# EasyEDA Pro project ProPrj_ftdi-jtag-xilinx_2025-01-01.epro, schematic Schematic1

## Sheets
1 FT2232HQ: Board Name: Board1; Create Date: 2024-12-31; Page Name: FT2232HQ; Project Name: ftdi-jtag-xilinx; Schematic Name: Schematic1; Update Date: 2024-12-31; Company: 嘉立创EDA; Page Size: A4; Version: V1.0
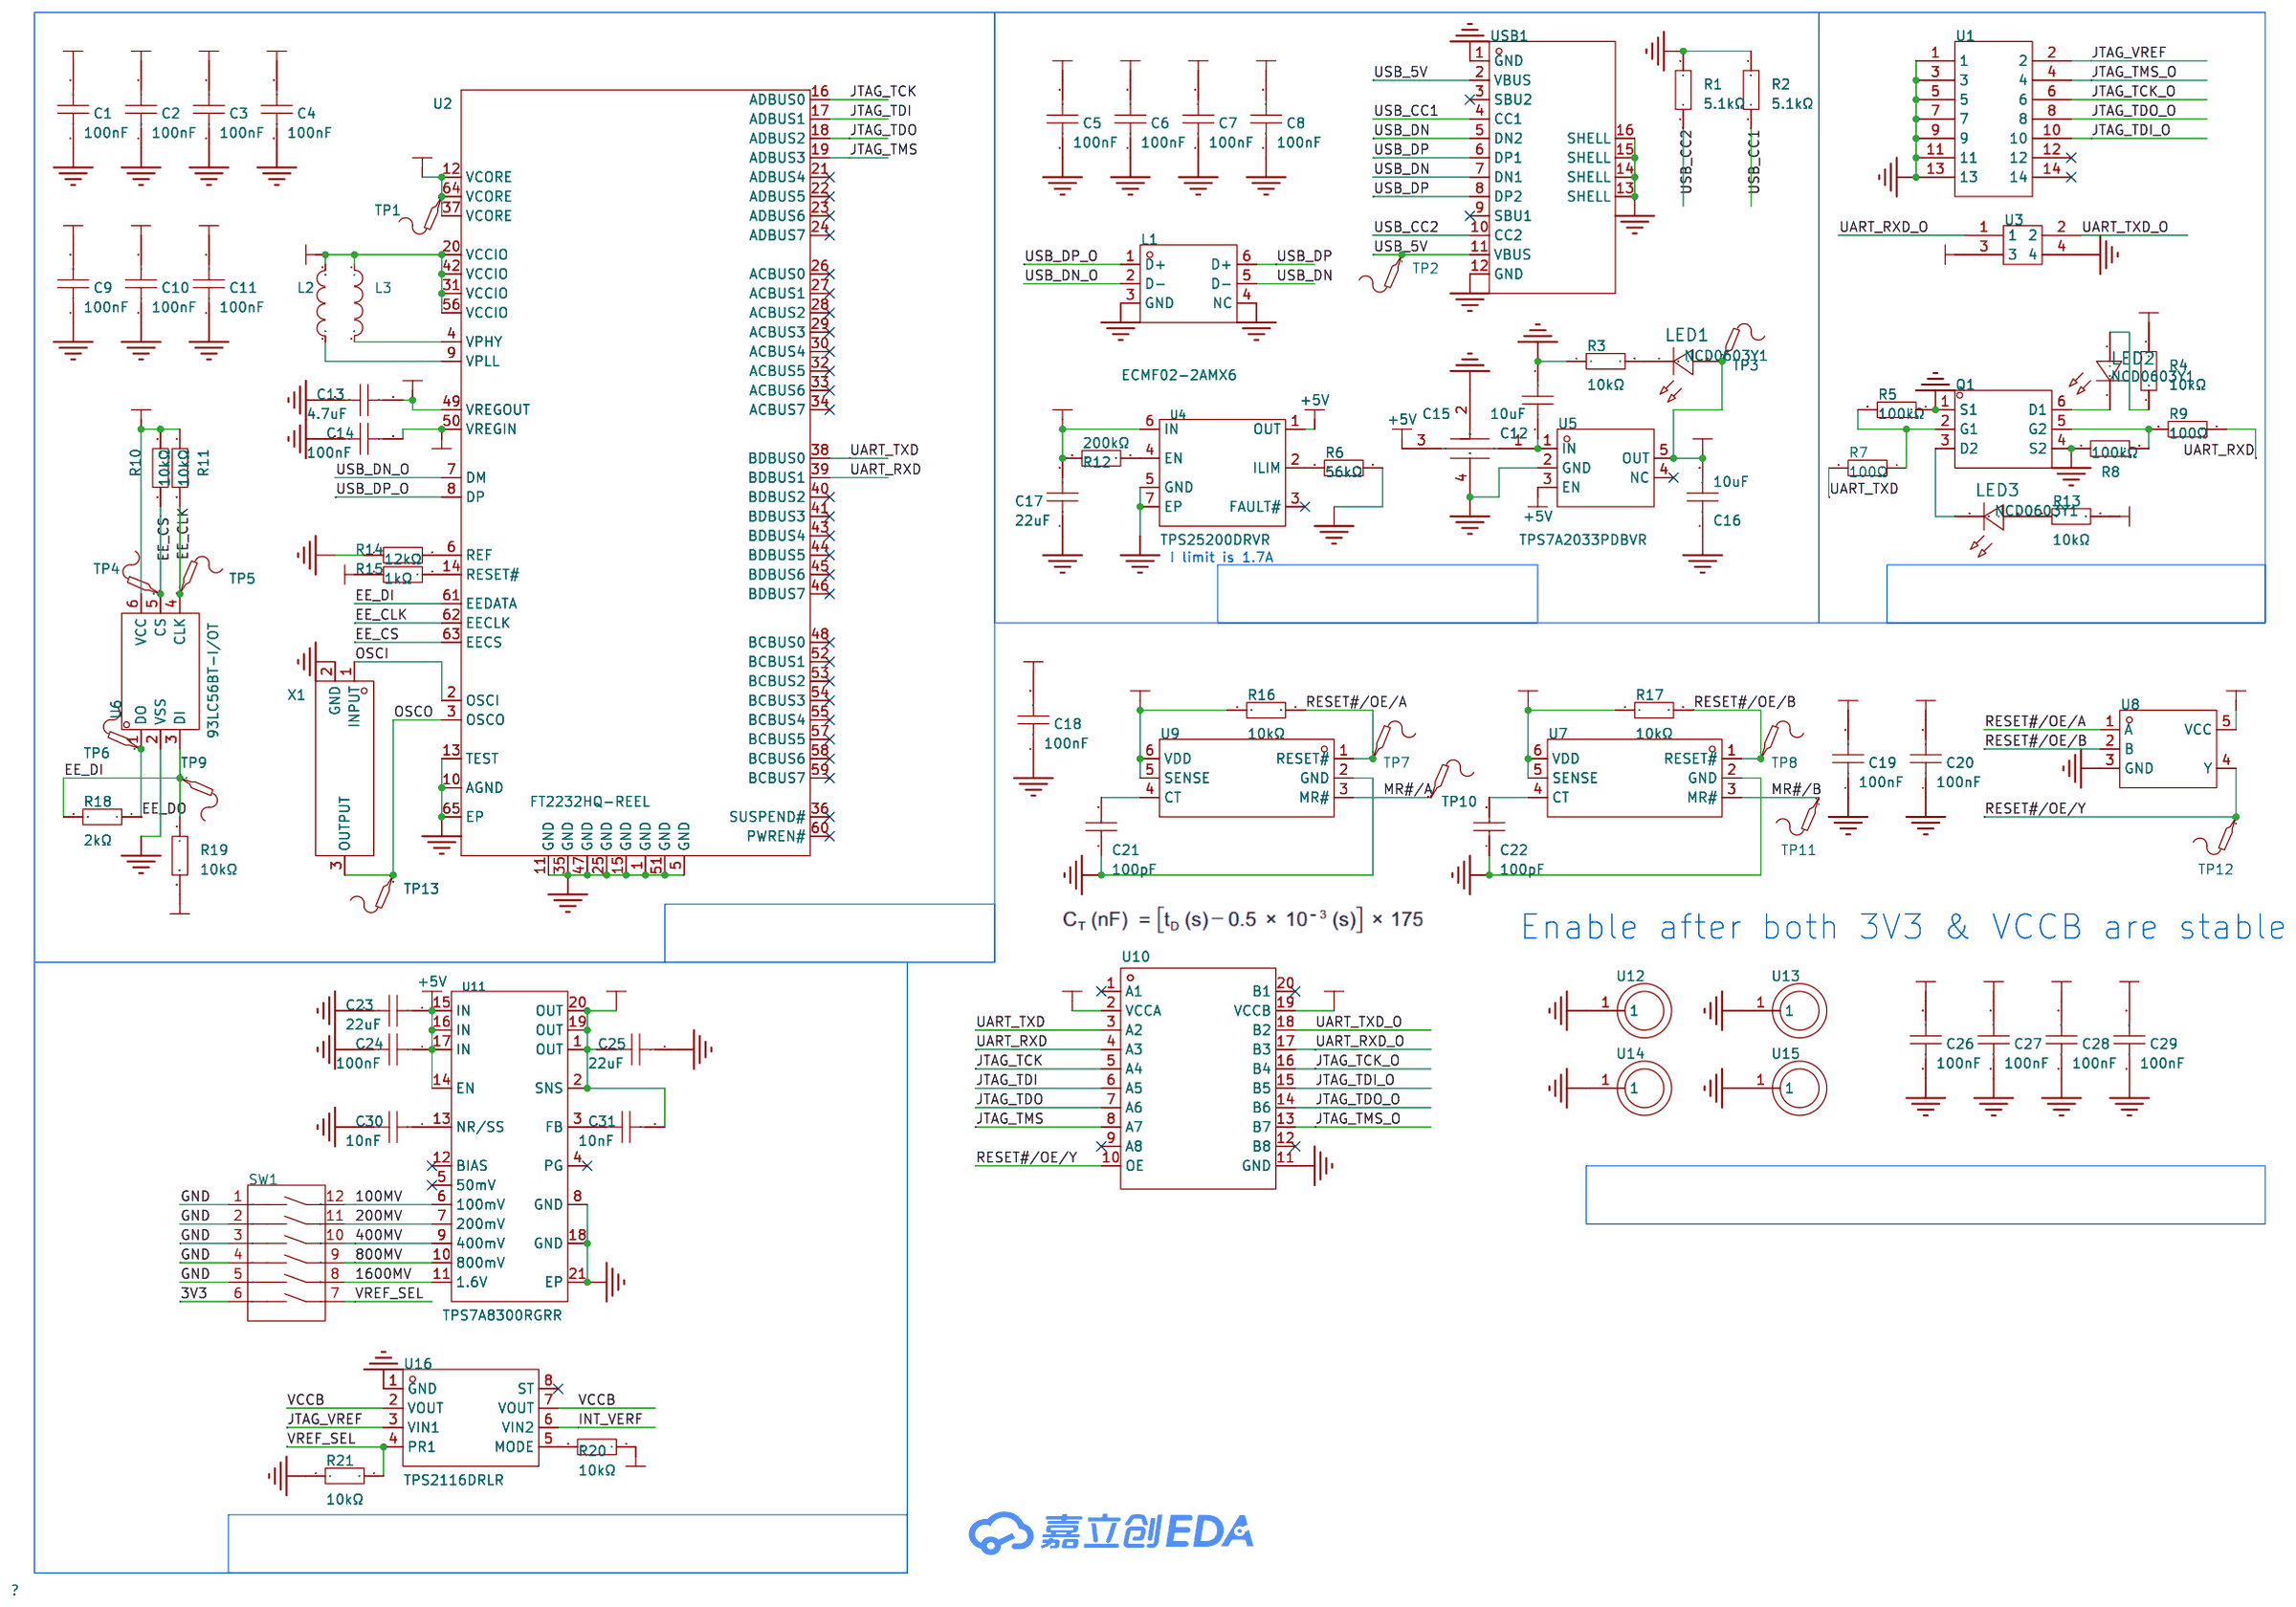
[diagram p0: FT2232HQ]
2 JTAG Adapter: Page Name: JTAG Adapter
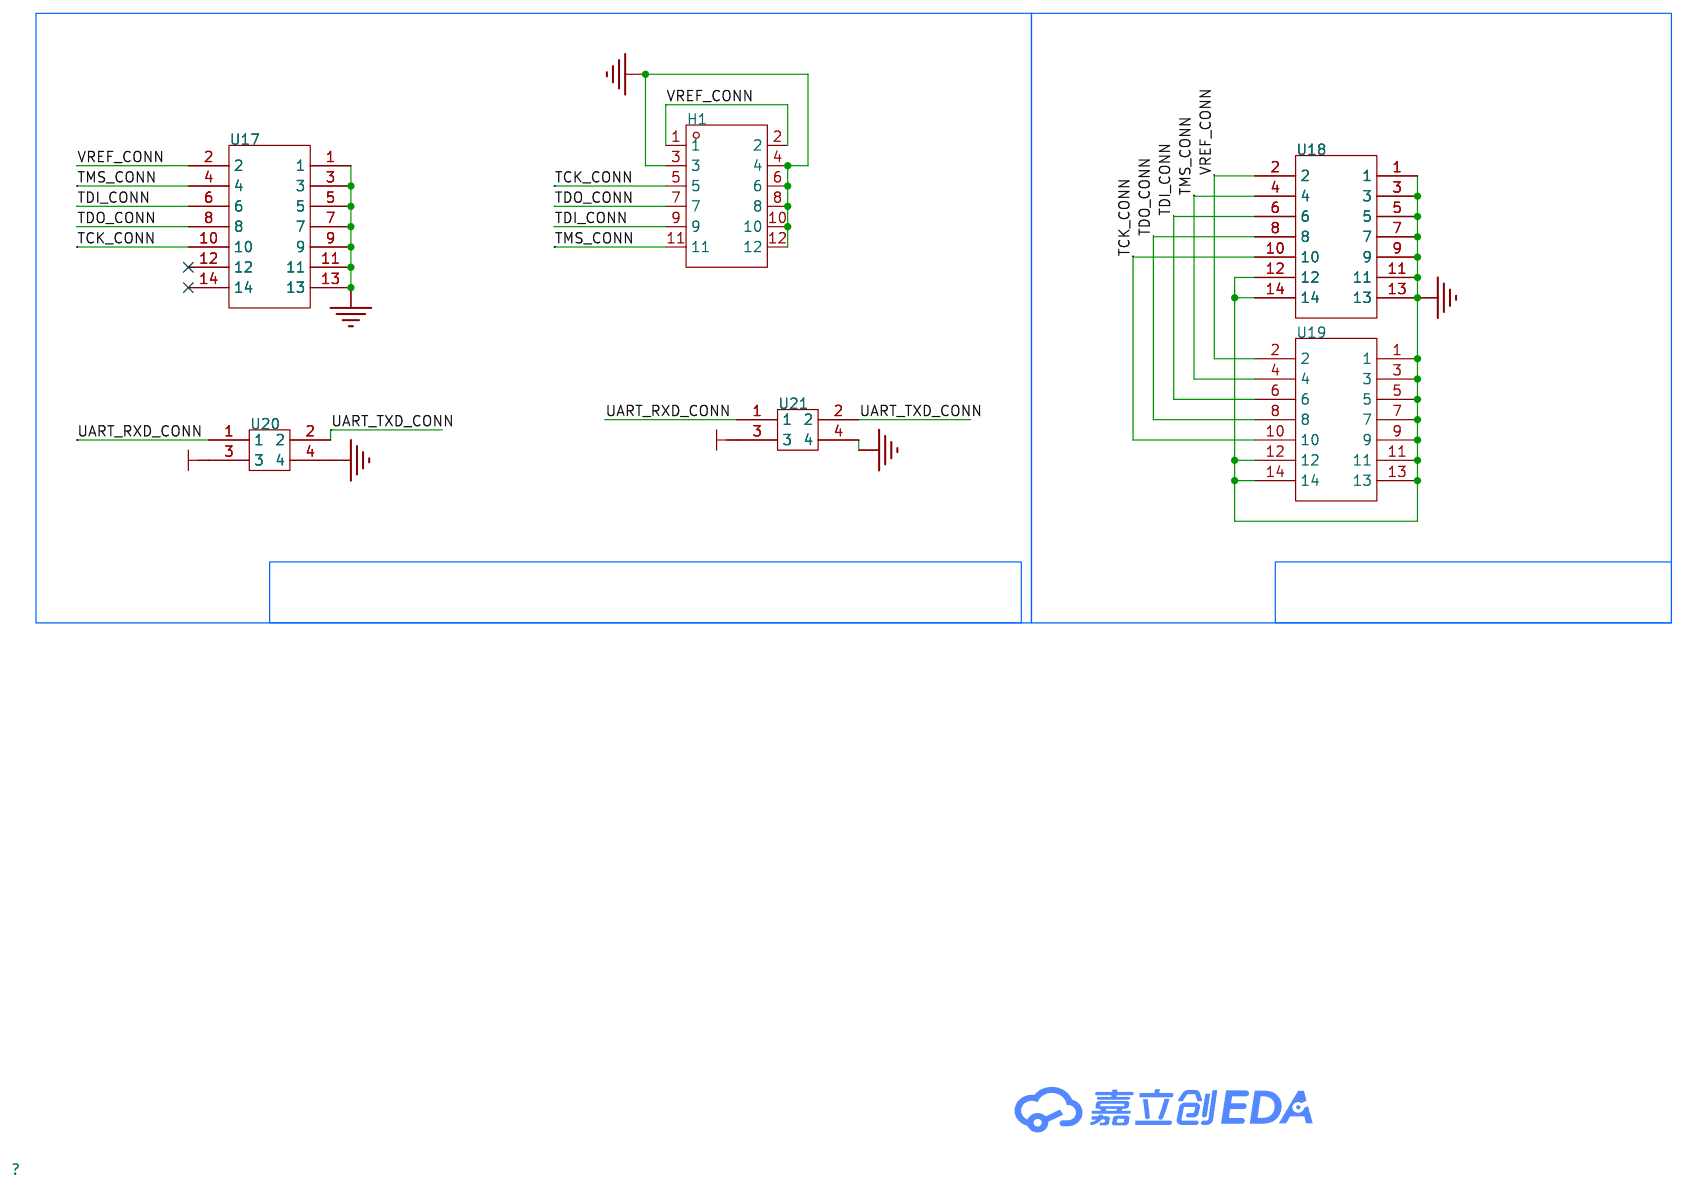
[diagram p1: JTAG Adapter]
3 Overview: Page Name: Overview
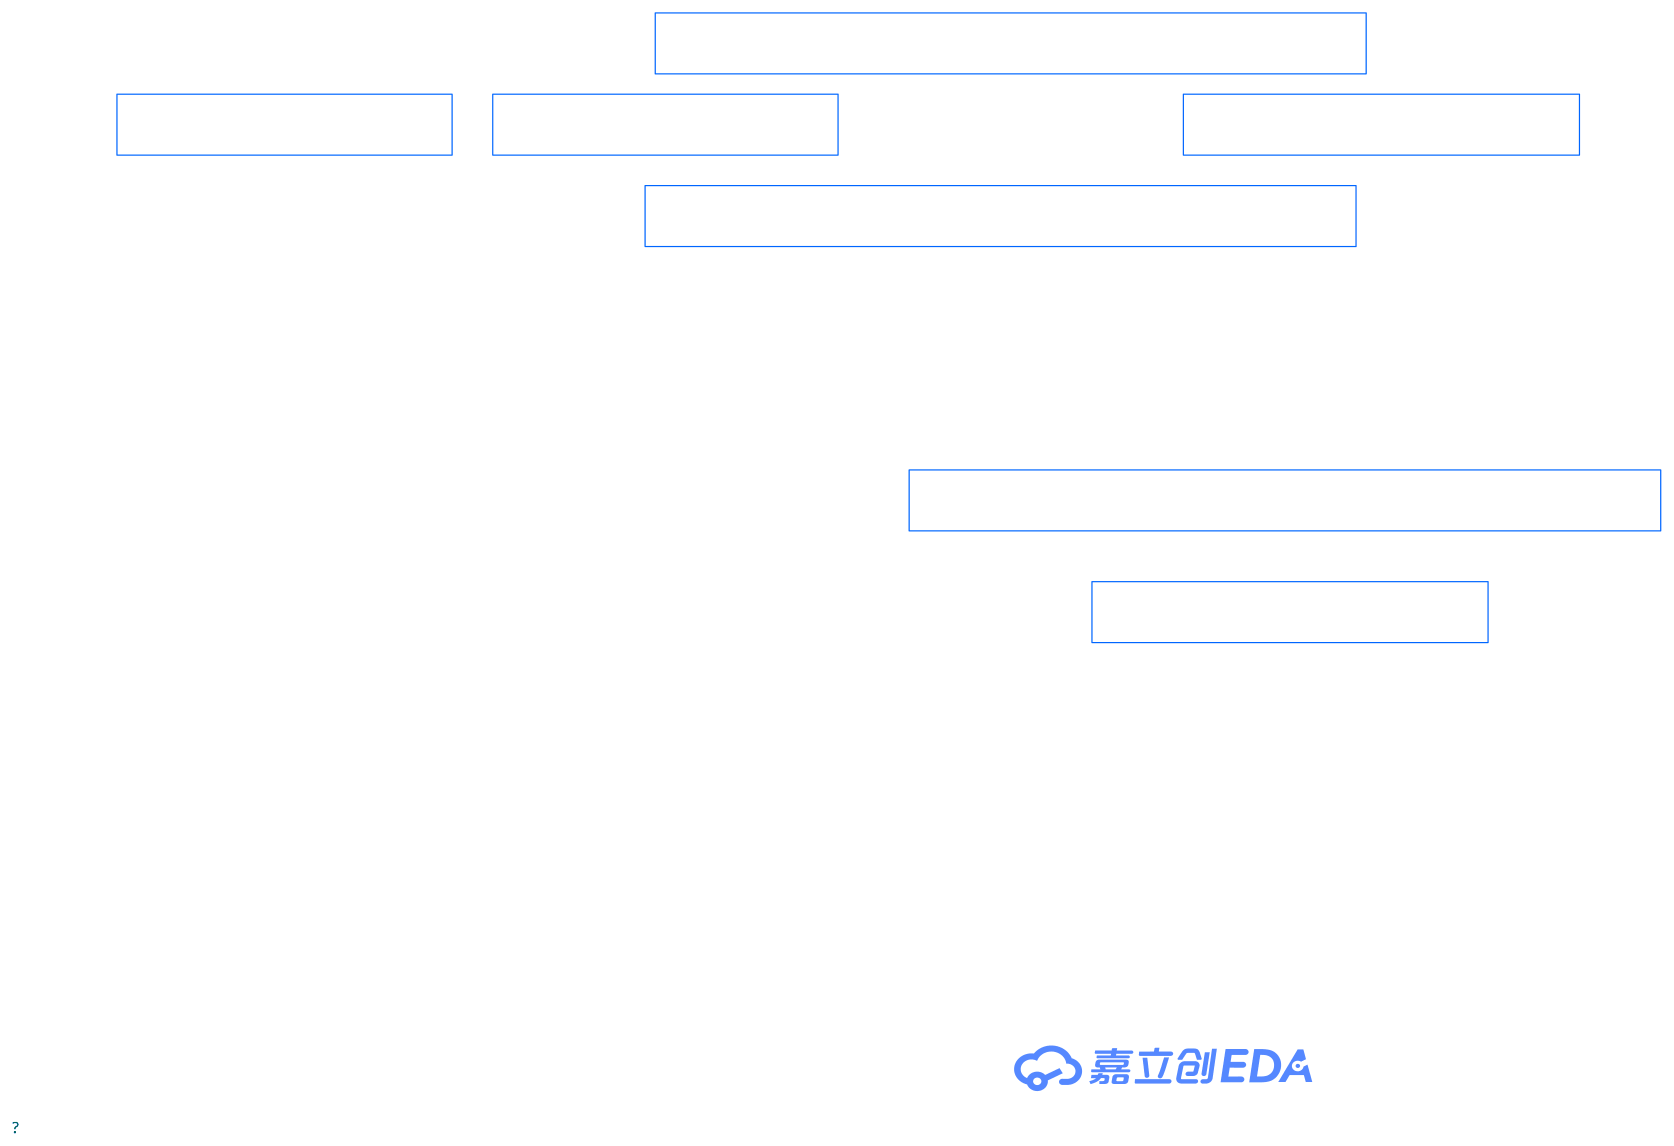
[diagram p2: Overview]

## Parts
sheet FT2232HQ
C1  100nF  [C0402]
C2  100nF  [C0402]
C3  100nF  [C0402]
C4  100nF  [C0402]
C5  100nF  [C0402]
C6  100nF  [C0402]
C7  100nF  [C0402]
C8  100nF  [C0402]
C9  100nF  [C0402]
C10  100nF  [C0402]
C11  100nF  [C0402]
C12  10uF  [C0603]
C13  4.7uF  [C0402]
C14  100nF  [C0402]
C15  NFM21PC104R1E3D  [CAP-SMD_4P-L2.0-W1.25]
C16  10uF  [C0603]
C17  22uF  [C0805]
C18  100nF  [C0402]
C19  100nF  [C0402]
C20  100nF  [C0402]
C21  100pF  [C0402]
C22  100pF  [C0402]
C23  22uF  [C0805]
C24  100nF  [C0402]
C25  22uF  [C0805]
C26  100nF  [C0402]
C27  100nF  [C0402]
C28  100nF  [C0402]
C29  100nF  [C0402]
C30  10nF  [C0402]
C31  10nF  [C0402]
L1  ECMF02-2AMX6  [UFQFN-6_L1.7-W1.5]
L2  BLM15PD121SN1D  [L0402]
L3  BLM15PD121SN1D  [L0402]
LED1  NCD0603Y1  [LED0603-RD]
LED2  NCD0603Y1  [LED0603-RD]
LED3  NCD0603Y1  [LED0603-RD]
Q1  BSS138PS,115  [SOT-363_L2.0-W1.3-P0.65-LS2.1-BR]
R1  5.1kΩ  [R0402]
R2  5.1kΩ  [R0402]
R3  10kΩ  [R0402]
R4  10kΩ  [R0402]
R5  100kΩ  [R0402]
R6  56kΩ  [R0402]
R7  100Ω  [R0402]
R8  100kΩ  [R0402]
R9  100Ω  [R0402]
R10  10kΩ  [R0402]
R11  10kΩ  [R0402]
R12  200kΩ  [R0402]
R13  10kΩ  [R0402]
R14  12kΩ  [R0402]
R15  1kΩ  [R0402]
R16  10kΩ  [R0402]
R17  10kΩ  [R0402]
R18  2kΩ  [R0402]
R19  10kΩ  [R0402]
R20  10kΩ  [R0402]
R21  10kΩ  [R0402]
SW1  SMQP-06B-TP  [SW-TH_12P-P2.54_SMQP-06B-TP]
TP1  -  [Test-Point-0.5mm]
TP2  -  [Test-Point-0.5mm]
TP3  -  [Test-Point-0.5mm]
TP4  -  [Test-Point-0.5mm]
TP5  -  [Test-Point-0.5mm]
TP6  -  [Test-Point-0.5mm]
TP7  -  [Test-Point-0.5mm]
TP8  -  [Test-Point-0.5mm]
TP9  -  [Test-Point-0.5mm]
TP10  -  [Test-Point-0.5mm]
TP11  -  [Test-Point-0.5mm]
TP12  -  [Test-Point-0.5mm]
TP13  -  [Test-Point-0.5mm]
U1  -  [JTAG_V3]
U2  FT2232HQ-REEL  [QFN-64_L9.0-W9.0-P0.50-TL-EP4.3]
U3  -  [2x2p侧贴排针]
U4  TPS25200DRVR  [WSON-6_L2.0-W2.0-P0.65-TL-EP]
U5  TPS7A2033PDBVR  [SOT-23-5_L2.9-W1.6-P0.95-LS2.8-BR]
U6  93LC56BT-I/OT  [SOT-23-6_L2.9-W1.6-P0.95-LS2.8-BR]
U7  TPS3808G33DBVR  [SOT-23-6_L2.9-W1.6-P0.95-LS2.8-BR]
U8  SN74LVC1G08DBVR  [TSOT-23-5_L2.9-W1.6-P0.95-LS2.8-BR]
U9  TPS3808G33DBVR  [SOT-23-6_L2.9-W1.6-P0.95-LS2.8-BR]
U10  TXB0108PWR  [TSSOP-20_L6.5-W4.4-P0.65-LS6.4-BL]
U11  TPS7A8300RGRR  [VQFN-20_L3.5-W3.5-P0.50-BL-EP2.0]
U12  -  [M2焊接螺柱]
U13  -  [M2焊接螺柱]
U14  -  [M2焊接螺柱]
U15  -  [M2焊接螺柱]
U16  TPS2116DRLR  [SOT-583-8_L2.1-W1.6-P0.50-LS1.6-BL]
USB1  TYPEC-302-BRP16SC16  [USB-C-SMD_TYPEC-302-BRP16SC16]
X1  12MHz  [CRYSTAL-SMD_3P-L3.2-W1.3-P1.2-BL]
sheet JTAG Adapter
H1  PZ2.54-2x6-11.2  [HDR-TH_12P-P2.54-V-M-R2-C6-S2.54]
U17  -  [JTAG_V3]
U18  -  [JTAG_V3]
U19  -  [JTAG_V3]
U20  -  [2x2p侧贴排针]
U21  -  [2x2p侧贴排针]

## Library data of the parts
C1-C11 C14 C18-C20 C24 C26-C29 = CC0402KRX7R7BB104: 容值:100nF;精度:±10%;额定电压:16V;材质(温度系数):X7R;; LCSC Part Name: 100nF ±10% 16V; Supplier Part: C60474; Manufacturer: YAGEO(国巨); Supplier Footprint: 0402; JLCPCB Part Class: Extended Part; Datasheet: https://atta.szlcsc.com/upload/public/pdf/source/20211223/9278FD768280B81DDBEF48FA36411A03.pdf; Supplier: LCSC; Tolerance: ±10%; Voltage Rated: 16V; Temperature Coefficient: X7R
C12 C16 = CL10A106MA8NRNC: 容值:10uF;精度:±20%;额定电压:25V;材质(温度系数):X5R;; LCSC Part Name: 10uF ±20% 25V; Supplier Part: C96446; Manufacturer: SAMSUNG(三星); Supplier Footprint: 0603; JLCPCB Part Class: Basic Part; Datasheet: https://atta.szlcsc.com/upload/public/pdf/source/20160218/1457707763339.pdf; Supplier: LCSC; Tolerance: ±20%; Voltage Rated: 25V; Temperature Coefficient: X5R
C13 = CL05A475KP5NRNC: 容值:4.7uF;精度:±10%;额定电压:10V;材质(温度系数):X5R;; LCSC Part Name: 4.7uF ±10% 10V; Supplier Part: C368809; Manufacturer: SAMSUNG(三星); Supplier Footprint: 0402; JLCPCB Part Class: Extended Part; Datasheet: https://atta.szlcsc.com/upload/public/pdf/source/20160218/1457707763339.pdf; Supplier: LCSC; Tolerance: ±10%; Voltage Rated: 10V; Temperature Coefficient: X5R
C15 = NFM21PC104R1E3D: 电容量:100nF;精度:±20%;直流电阻:30mΩ;; LCSC Part Name: 100nF(104) ±20% 25V; Supplier Part: C86150; Manufacturer: muRata(村田); Supplier Footprint: 0805; JLCPCB Part Class: 扩展库; Datasheet: https://atta.szlcsc.com/upload/public/pdf/source/20180326/C86150_E4B7366323682FA84DED9003C68CA797.pdf; Supplier: LCSC; Nominal Capacitance: 100nF; CapacitanceTolerance: ±20%; DC Rated Voltage: 25V; Rated Current: 2A; DC Resistance: 30mΩ; Operating Temperature: -55℃~+125℃
C17 C23 C25 = CGA0805X5R226M350MT: 容值:22uF;精度:±20%;额定电压:35V;材质(温度系数):X5R;; LCSC Part Name: 22uF ±20% 35V; Supplier Part: C6119901; Manufacturer: HRE(芯声); Supplier Footprint: 0805; JLCPCB Part Class: Extended Part; Datasheet: https://atta.szlcsc.com/upload/public/pdf/source/20231129/D589D0CC4D260F7AC3A77E53B455CCB3.pdf; Supplier: LCSC; Tolerance: ±20%; Voltage Rated: 35V; Temperature Coefficient: X5R
C21 C22 = CC0402JRNPO9BN101: 容值:100pF;精度:±5%;额定电压:50V;材质(温度系数):NP0;; LCSC Part Name: 100pF ±5% 50V; Supplier Part: C106200; Manufacturer: YAGEO(国巨); Supplier Footprint: 0402; JLCPCB Part Class: 扩展库; Datasheet: https://atta.szlcsc.com/upload/public/pdf/source/20170505/1493957838062.pdf; Supplier: LCSC; Tolerance: ±5%; Voltage Rated: 50V; Temperature Coefficient: NP0
C30 C31 = CC0402KRX7R9BB103: 容值:10nF;精度:±10%;额定电压:50V;材质(温度系数):X7R;; LCSC Part Name: 10nF ±10% 50V; Supplier Part: C60133; Manufacturer: YAGEO(国巨); Supplier Footprint: 0402; JLCPCB Part Class: Extended Part; Datasheet: https://atta.szlcsc.com/upload/public/pdf/source/20180224/C181747_15194369449651363981.pdf; Supplier: LCSC; Tolerance: ±10%; Voltage Rated: 50V; Temperature Coefficient: X7R
L1 = ECMF02-2AMX6: 线路数:2;直流电阻(DCR):2.5Ω;; Supplier Part: C2651144; Manufacturer: ST(意法半导体); Supplier Footprint: UFQFN-6(1.5x1.7); JLCPCB Part Class: 扩展库; Datasheet: https://atta.szlcsc.com/upload/public/pdf/source/20210702/5ABAEB64ABBB5666ADAF5B85EB7C19E4.pdf; Supplier: LCSC; Number of Lines: 2; Current Rating: 200mA; DC Resistance (DCR): 2.5Ω; Operating Temperature: -40℃~+85℃
L2 L3 = BLM15PD121SN1D: 标称阻抗@测试频率:120Ω@100MHz;误差:±25%;直流电阻(RDC):90mΩ;; LCSC Part Name: 单路 0402磁珠 阻抗120Ω@100MHz; Supplier Part: C76891; Manufacturer: muRata(村田); Supplier Footprint: 0402; Datasheet: https://atta.szlcsc.com/upload/public/pdf/source/20180326/C76891_C89C2C1119D9992B67A2515C9BBB882D.pdf; Supplier: LCSC; Impedance @ Frequency: 120Ω@100MHz; Tolerance: ±25%; DC Resistance: 90mΩ; Current Rating: 1.3A; Circuits: 1
LED1-LED3 = NCD0603Y1: 发光颜色:黄色;正向电压(VF):1.6V~2.6V;功率:65mW;正向电流:20mA;主波长:586nm~595nm;透镜颜色:无色透明透镜;发光强度:80mcd~220mcd;发光角度:130°;工作温度:-30℃~+85℃;; Supplier Part: C84268; Manufacturer: 国星光电; Supplier Footprint: 0603; JLCPCB Part Class: Extended Part; Datasheet: https://atta.szlcsc.com/upload/public/pdf/source/20200820/C84268_8FC106CB292CF978F9CFC6892464F83C.pdf; Supplier: LCSC; Emitted Color: 黄色; Forward Voltage (VF): 1.6V~2.6V; Power Dissipation: 65mW; Forward Current: 20mA; Dominant Wavelength: 586nm~595nm; Lens Color: 无色透明透镜; Luminous Intensity: 80mcd~220mcd; Viewing Angle: 130°; Operating Temperature: -30℃~+85℃
Q1 = BSS138PS,115: 类型:N沟道;漏源电压(Vdss):60V;连续漏极电流(Id):320mA;功率(Pd):420mW;导通电阻(RDS(on)@Vgs,Id):1.6Ω@10V,300mA;阈值电压(Vgs(th)@Id):1.5V@250uA;; LCSC Part Name: N沟道 耐压:60V 电流:320mA; Supplier Part: C193381; Manufacturer: Nexperia(安世); Supplier Footprint: SOT-363; JLCPCB Part Class: 扩展库; Datasheet: https://atta.szlcsc.com/upload/public/pdf/source/20180622/C193381_B49DD77FDC8C7FC4082E576565E3EEEF.pdf; Supplier: LCSC; Type: N沟道; Drain Source Voltage (Vdss): 60V; Continuous Drain Current (Id): 320mA; Power Dissipation (Pd): 420mW; Drain Source On Resistance (RDS(on)@Vgs,Id): 1.6Ω@10V,300mA; Gate Threshold Voltage (Vgs(th)@Id): 1.5V@250uA; Total Gate Charge (Qg@Vgs): 800pC@4.5V; Input Capacitance (Ciss@Vds): 50pF@10V
R1 R2 = 0402WGF5101TCE: 电阻类型:厚膜电阻;阻值:5.1kΩ;精度:±1%;功率:62.5mW;最大工作电压:50V;温度系数:±100ppm/℃;; LCSC Part Name: 5.1kΩ ±1% 62.5mW 厚膜电阻; Supplier Part: C25905; Manufacturer: UNI-ROYAL(厚声); Supplier Footprint: 0402; JLCPCB Part Class: Basic Part; Datasheet: https://atta.szlcsc.com/upload/public/pdf/source/20200306/C422600_1E6D84923E4A46A82E41ADD87F860B5C.pdf; Supplier: LCSC; Type: 厚膜电阻; Tolerance: ±1%; Power(Watts): 62.5mW; Overload Voltage (Max): 50V; Temperature Coefficient: ±100ppm/℃; Operating Temperature Range: -55℃~+155℃
R3 R4 R10 R11 R13 R16 R17 R19-R21 = RC0402FR-0710KL: 电阻类型:厚膜电阻;阻值:10kΩ;精度:±1%;功率:62.5mW;最大工作电压:50V;温度系数:±100ppm/℃;; LCSC Part Name: 厚膜电阻 10kΩ ±1% 62.5mW; Supplier Part: C60490; Manufacturer: YAGEO(国巨); Supplier Footprint: 0402; JLCPCB Part Class: Extended Part; Datasheet: https://atta.szlcsc.com/upload/public/pdf/source/20170925/C131467_1506321478108990263.pdf; Supplier: LCSC; Type: 厚膜电阻; Tolerance: ±1%; Power(Watts): 62.5mW; Overload Voltage (Max): 50V; Temperature Coefficient: ±100ppm/℃; Operating Temperature Range: -55℃~+155℃
R5 R8 = RC0402FR-07100KL: 电阻类型:厚膜电阻;阻值:100kΩ;精度:±1%;功率:62.5mW;最大工作电压:50V;温度系数:±100ppm/℃;; LCSC Part Name: 厚膜电阻 100kΩ ±1% 62.5mW; Supplier Part: C60491; Manufacturer: YAGEO(国巨); Supplier Footprint: 0402; JLCPCB Part Class: Extended Part; Datasheet: https://atta.szlcsc.com/upload/public/pdf/source/20180927/C295883_E8D83085EA81BD7DE0B2B681138C15EE.pdf; Supplier: LCSC; Type: 厚膜电阻; Tolerance: ±1%; Power(Watts): 62.5mW; Overload Voltage (Max): 50V; Temperature Coefficient: ±100ppm/℃; Operating Temperature Range: -55℃~+155℃
R6 = 0402WGF5602TCE: 电阻类型:厚膜电阻;阻值:56kΩ;精度:±1%;功率:62.5mW;最大工作电压:50V;温度系数:±100ppm/℃;; LCSC Part Name: 56kΩ ±1% 62.5mW 厚膜电阻; Supplier Part: C25796; Manufacturer: UNI-ROYAL(厚声); Supplier Footprint: 0402; JLCPCB Part Class: Extended Part; Datasheet: https://atta.szlcsc.com/upload/public/pdf/source/20200306/C422600_1E6D84923E4A46A82E41ADD87F860B5C.pdf; Supplier: LCSC; Type: 厚膜电阻; Tolerance: ±1%; Power(Watts): 62.5mW; Overload Voltage (Max): 50V; Temperature Coefficient: ±100ppm/℃; Operating Temperature Range: -55℃~+155℃
R7 R9 = 0402WGF1000TCE: 电阻类型:厚膜电阻;阻值:100Ω;精度:±1%;功率:62.5mW;最大工作电压:50V;温度系数:±200ppm/℃;; LCSC Part Name: 100Ω ±1% 62.5mW 厚膜电阻; Supplier Part: C25076; Manufacturer: UNI-ROYAL(厚声); Supplier Footprint: 0402; JLCPCB Part Class: Basic Part; Datasheet: https://atta.szlcsc.com/upload/public/pdf/source/20200306/C422600_1E6D84923E4A46A82E41ADD87F860B5C.pdf; Supplier: LCSC; Type: 厚膜电阻; Tolerance: ±1%; Power(Watts): 62.5mW; Overload Voltage (Max): 50V; Temperature Coefficient: ±200ppm/℃; Operating Temperature Range: -55℃~+155℃
R12 = 0402WGF2003TCE: 电阻类型:厚膜电阻;阻值:200kΩ;精度:±1%;功率:62.5mW;最大工作电压:50V;温度系数:±100ppm/℃;; LCSC Part Name: 200kΩ ±1% 62.5mW 厚膜电阻; Supplier Part: C25764; Manufacturer: UNI-ROYAL(厚声); Supplier Footprint: 0402; JLCPCB Part Class: Basic Part; Datasheet: https://atta.szlcsc.com/upload/public/pdf/source/20200306/C422600_1E6D84923E4A46A82E41ADD87F860B5C.pdf; Supplier: LCSC; Type: 厚膜电阻; Tolerance: ±1%; Power(Watts): 62.5mW; Overload Voltage (Max): 50V; Temperature Coefficient: ±100ppm/℃; Operating Temperature Range: -55℃~+155℃
R14 = 0402WGF1202TCE: 电阻类型:厚膜电阻;阻值:12kΩ;精度:±1%;功率:62.5mW;最大工作电压:50V;温度系数:±100ppm/℃;; LCSC Part Name: 12kΩ ±1% 62.5mW 厚膜电阻; Supplier Part: C25752; Manufacturer: UNI-ROYAL(厚声); Supplier Footprint: 0402; JLCPCB Part Class: Basic Part; Datasheet: https://atta.szlcsc.com/upload/public/pdf/source/20200306/C422600_1E6D84923E4A46A82E41ADD87F860B5C.pdf; Supplier: LCSC; Type: 厚膜电阻; Tolerance: ±1%; Power(Watts): 62.5mW; Overload Voltage (Max): 50V; Temperature Coefficient: ±100ppm/℃; Operating Temperature Range: -55℃~+155℃
R15 = 0402WGF1001TCE: 电阻类型:厚膜电阻;阻值:1kΩ;精度:±1%;功率:62.5mW;最大工作电压:50V;温度系数:±100ppm/℃;; LCSC Part Name: 1kΩ ±1% 62.5mW 厚膜电阻; Supplier Part: C11702; Manufacturer: UNI-ROYAL(厚声); Supplier Footprint: 0402; JLCPCB Part Class: Basic Part; Datasheet: https://atta.szlcsc.com/upload/public/pdf/source/20200306/C422600_1E6D84923E4A46A82E41ADD87F860B5C.pdf; Supplier: LCSC; Type: 厚膜电阻; Tolerance: ±1%; Power(Watts): 62.5mW; Overload Voltage (Max): 50V; Temperature Coefficient: ±100ppm/℃; Operating Temperature Range: -55℃~+155℃
R18 = FRC0402F2001TS: 电阻类型:厚膜电阻;阻值:2kΩ;精度:±1%;功率:62.5mW;最大工作电压:50V;温度系数:±100ppm/℃;; LCSC Part Name: 2kΩ ±1% 62.5mW 厚膜电阻; Supplier Part: C2909344; Manufacturer: FOJAN(富捷); Supplier Footprint: 0402; JLCPCB Part Class: Extended Part; Datasheet: https://atta.szlcsc.com/upload/public/pdf/source/20211221/925EC7D7225764EE0046F22065062C87.pdf; Supplier: LCSC; Type: 厚膜电阻; Tolerance: ±1%; Power(Watts): 62.5mW; Overload Voltage (Max): 50V; Temperature Coefficient: ±100ppm/℃; Operating Temperature Range: -55℃~+155℃
SW1 = SMQP-06B-TP: 类型:琴键;电路结构:-;开关位数:6位;额定电流:25mA;额定电压:24V;使用寿命:5千次;颜色:蓝色;; LCSC Part Name: 间距2.54mm 琴键6位拨码开关; Supplier Part: C5299496; Manufacturer: SM Switch; JLCPCB Part Class: 扩展库; Datasheet: https://atta.szlcsc.com/upload/public/pdf/source/20230428/70B55ED7BA6FDEB5D2D5B22165FF4512.pdf; Supplier: LCSC; Type: 琴键; Number of Positions: 6位; Lead Pitch: 2.54mm; Current Rating: 25mA; Voltage Rating: 24V; Operating Temperature: -40℃~+85℃; Operating Life: 5千次; Color: 蓝色
TP1-TP13 = Test-Point: Test Point 测试点; Check: false
U1 U17-U19 = jtagv4: Check: false
U2 = FT2232HQ-REEL: 应用功能:USB转UART；USB转FIFO;接口协议:UART;供电电压:3V~3.6V;; Supplier Part: C193662; Manufacturer: FTDI(飞特帝亚); Supplier Footprint: QFN-64-EP(9x9); JLCPCB Part Class: 扩展库; Datasheet: https://atta.szlcsc.com/upload/public/pdf/source/20180530/C193662_F14B45A4B5271BE746E436B0F2E041EE.pdf; Supplier: LCSC; Applications Function: USB转UART；USB转FIFO; Protocol: UART; Supply Voltage: 3V~3.6V; Operating Temperature: -40℃~+85℃
U3 U20 U21 = 2: Check: false
U4 = TPS25200DRVR: TPS25200 具有过压钳位的 6.5V/2.8A 电子保险丝; Supplier: LCSC; Manufacturer: TI(德州仪器); Supplier Part: C128401; JLCPCB Part Class: 扩展库; Supplier Footprint: WSON-6-EP(2x2); Datasheet: https://www.ti.com/cn/lit/gpn/tps25200
U5 = TPS7A2033PDBVR: Supplier Part: C2862740; Manufacturer: TI(德州仪器); Supplier Footprint: SOT-23-5; JLCPCB Part Class: 扩展库; Datasheet: https://atta.szlcsc.com/upload/public/pdf/source/20230221/9B73099824E408F4B24BD95C528A27ED.pdf; Supplier: LCSC
U6 = 93LC56BT-I/OT: The Microchip 93LC56B device is a 2Kb Microwire (3-wire) Serial EEPROM with dedicated 16-bit memory organization and a voltage operation range of 2.5 - 5.5V.? Also available are the 93LC56A for dedicated 8-bit memory organization and the 93LC56C for hardw; Supplier Part: C190271; Manufacturer: MICROCHIP(美国微芯); Supplier Footprint: SOT-23-6; Datasheet: https://atta.szlcsc.com/upload/public/pdf/source/20180423/C190271_ABAD329DACFE2165969EA1B02E3F54C8.pdf; Supplier: LCSC
U7 U9 = TPS3808G33DBVR: 复位有效电平:低电平有效;受监控电压数:1;复位超时:-;; Supplier Part: C43698; Manufacturer: TI(德州仪器); Supplier Footprint: SOT-23-6; JLCPCB Part Class: 扩展库; Datasheet: https://www.ti.com/cn/lit/gpn/tps3808; Supplier: LCSC; ChipType: 简单复位/加电复位; Output Type: 开漏; Reset Active Level: 低电平有效; Threshold Voltage: 3.07V; Number of Voltages Monitored: 1; Operating Temperature: -40℃~+125℃@(TJ)
U8 = SN74LVC1G08DBVR_C434068: 逻辑类型:与门;通道数:1;电源电压:1.65V~5.5V;静态电流(最大值):10uA;最大传播延迟:10ns@5V,15pF;; LCSC Part Name: 门极和反相器; Supplier Part: C434068; Manufacturer: UMW(友台半导体); Supplier Footprint: SOT-23-5; JLCPCB Part Class: 扩展库; Datasheet: https://atta.szlcsc.com/upload/public/pdf/source/20241113/984F0765BD3116AA5844B02C7C0EC901.pdf; Supplier: LCSC; Logic Gate Type: 与门; Number of Channels: 1; Supply Voltage: 1.65V~5.5V; Quiescent Current (Max): 10uA; Sink Current: 32mA; Source Current: 32mA; High Level Range (VIH): 1.7V; Series: 74LVC系列; Propagation Delay Time: 10ns@5V,15pF; Operating Temperature: -40℃~+105℃
U10 = TXB0108PWR: 数据速率:100Mbps;电压(VCCA):1.2V~3.6V;电压(VCCB):1.65V~5.5V;电路数:1;每个电路通道数:8;; LCSC Part Name: 100Mbps 8位双向电平转换器; Supplier Part: C53406; Manufacturer: TI(德州仪器); Supplier Footprint: TSSOP-20; JLCPCB Part Class: 扩展库; Datasheet: https://www.ti.com/cn/lit/gpn/txb0108; Supplier: LCSC; Channel Type: 双向; Data Rate: 100Mbps; Supply Voltage (VCCA): 1.2V~3.6V; Supply Voltage (VCCB): 1.65V~5.5V; Number of Circuits: 1; Channels per Circuit: 8; Output Type: 三态；非反相; Operating Temperature: -40℃~+85℃; Features: 自动方向检测
U11 = TPS7A8300RGRR: 输出类型:-;; Supplier: LCSC; Supplier Part: C544500; Manufacturer: TI(德州仪器); JLCPCB Part Class: 扩展库; Supplier Footprint: VQFN-20-EP(3.5x3.5); Datasheet: https://www.ti.com/cn/lit/gpn/tps7a8300
U12-U15 = M2焊接螺柱: Check: false
U16 = TPS2116DRLR: 通道数:1;输出电流:2.5A;输入电压:1.6V~5.5V;导通电阻:42mΩ;; Supplier Part: C3235557; Manufacturer: TI(德州仪器); Supplier Footprint: SOT-583; JLCPCB Part Class: 扩展库; Datasheet: https://www.ti.com/cn/lit/gpn/tps2116; Supplier: LCSC; Number of Outputs: 1; Output Current: 2.5A; Input Voltage: 1.6V~5.5V; Resistor On-State: 42mΩ; Operating Temperature	-: -40℃~+105℃
USB1 = TYPEC-302-BRP16SC16: 连接器类型:Type-C;标准:USB 3.1;公母:母;端口数量:1;触点数量:16P;安装方式:沉板;额定电流 - 电源:5A;工作温度范围:-45℃~+85℃;焊接温度(最大值):260℃;; LCSC Part Name: Type-C 母 沉板; Supplier Part: C2835313; Manufacturer: XUNPU(讯普); Supplier Footprint: SMD; JLCPCB Part Class: 扩展库; Datasheet: https://atta.szlcsc.com/upload/public/pdf/source/20210629/C2835313_96CAAD9C15DFF4F1D03DDC0B4E6AD92A.pdf; Supplier: LCSC; Connector Type: Type-C; Standard: USB 3.1; Gender: 母; Number of Ports: 1; Number of Contacts: 16P; Mounting Style: 沉板; Current Rating - Power (Max): 5A; Operating Temperature Range: -45℃~+85℃; Soldering Temperature(Max): 260℃
X1 = CSTNE12M0G52A000R0: 频率:12MHz;内置负载电容:10pF;谐振阻抗:30Ω;; LCSC Part Name: 12MHz ±0.5% 内置负载电容:10pF; Supplier Part: C907957; Manufacturer: muRata(村田); Supplier Footprint: SMD3213-3P; JLCPCB Part Class: 扩展库; Datasheet: https://atta.szlcsc.com/upload/public/pdf/source/20201022/C907957_8E07C565874D4A99F6305262E18BC732.pdf; Supplier: LCSC; Built-in Load Capacitance: 10pF; Resonant Impedance: 30Ω; Operating Temperature: -40℃~+125℃
H1 = PZ2.54-2x6-11.2: LCSC Part Name: 排针 2*6 2.54 11.2MM; Supplier Part: C29779989; Manufacturer: ZHOURI(洲日); Supplier Footprint: 插件,P=2.54mm; JLCPCB Part Class: 扩展库; Datasheet: https://atta.szlcsc.com/upload/public/pdf/source/20240716/32C05CE2216495DDDE0C72C1E62EDEE1.pdf; Supplier: LCSC

## Nets
3V3: C1.2 C2.2 C3.2 C4.2 C5.2 C6.2 C7.2 C8.2 C14.2 C16.2 C18.2 C20.2 C26.2 C27.2 L2.2 L3.1 LED1.2(A) R4.2 R10.1 R11.1 R13.1 R15.1 R16.1 R19.2 R20.1 SW1.6 TP3.1 U2.20(VCCIO) U2.31(VCCIO) U2.42(VCCIO) U2.50(VREGIN) U2.56(VCCIO) U3.3 U5.5(OUT) U6.6(VCC) U8.5(VCC) U9.5(SENSE) U9.6(VDD) U10.2(VCCA)
3V3_CONN: U20.3 U21.3
+5V: C15.3(OUT) C23.2 C24.1 U4.1(OUT) U5.3(EN) U11.14(EN) U11.15(IN) U11.16(IN) U11.17(IN)
GND: C1.1 C2.1 C3.1 C4.1 C5.1 C6.1 C7.1 C8.1 C9.1 C10.1 C11.1 C12.2 C13.2 C14.1 C15.2(GND) C15.4(GND) C16.1 C17.1 C18.1 C19.1 C20.1 C21.1 C22.1 C23.1 C24.2 C25.2 C26.1 C27.1 C28.1 C29.1 C30.2 H1.3 H1.4 H1.6 H1.8 H1.10 H1.12 L1.3(GND) L1.4(NC) Q1.1(S1) Q1.4(S2) R1.1 R2.1 R3.1 R5.1 R6.2 R8.2 R14.1 R21.1 SW1.1 SW1.2 SW1.3 SW1.4 SW1.5 U1.1 U1.3 U1.5 U1.7 U1.9 U1.11 U1.13 U2.1(GND) U2.5(GND) U2.10(AGND) U2.11(GND) U2.13(TEST) U2.15(GND) U2.25(GND) U2.35(GND) U2.47(GND) U2.51(GND) U2.65(EP) U3.4 U4.5(GND) U4.7(EP) U5.2(GND) U6.2(VSS) U7.2(GND) U8.3(GND) U9.2(GND) U10.11(GND) U11.8(GND) U11.18(GND) U11.21(EP) U12.1 U13.1 U14.1 U15.1 U16.1(GND) U17.1 U17.3 U17.5 U17.7 U17.9 U17.11 U17.13 U18.1 U18.3 U18.5 U18.7 U18.9 U18.11 U18.12 U18.13 U18.14 U19.1 U19.3 U19.5 U19.7 U19.9 U19.11 U19.12 U19.13 U19.14 U20.4 U21.4 USB1.1(GND) USB1.12(GND) USB1.13(SHELL) USB1.14(SHELL) USB1.15(SHELL) USB1.16(SHELL) X1.2(GND)
VCCB: C19.2 C28.2 C29.2 R17.1 U7.5(SENSE) U7.6(VDD) U10.19(VCCB) U16.2(VOUT) U16.7(VOUT)
100MV: SW1.12 U11.6(100mV)
200MV: SW1.11 U11.7(200mV)
400MV: SW1.10 U11.9(400mV)
800MV: SW1.9 U11.10(800mV)
1600MV: SW1.8 U11.11(1.6V)
EE_CLK: R11.2 TP5.1 U2.62(EECLK) U6.4(CLK)
EE_CS: R10.2 TP4.1 U2.63(EECS) U6.5(CS)
EE_DI: R18.2 R19.1 TP9.1 U2.61(EEDATA) U6.3(DI)
EE_DO: R18.1 TP6.1 U6.1(DO)
INT_VERF: C25.1 C31.1 U11.1(OUT) U11.2(SNS) U11.19(OUT) U11.20(OUT) U16.6(VIN2)
JTAG_TCK: U2.16(ADBUS0) U10.5(A4)
JTAG_TCK_O: U1.6 U10.16(B4)
JTAG_TDI: U2.17(ADBUS1) U10.6(A5)
JTAG_TDI_O: U1.10 U10.15(B5)
JTAG_TDO: U2.18(ADBUS2) U10.7(A6)
JTAG_TDO_O: U1.8 U10.14(B6)
JTAG_TMS: U2.19(ADBUS3) U10.8(A7)
JTAG_TMS_O: U1.4 U10.13(B7)
JTAG_VREF: U1.2 U16.3(VIN1)
MR#/A: TP10.1 U9.3(MR#)
MR#/B: TP11.1 U7.3(MR#)
OSCI: U2.2(OSCI) X1.1(INPUT)
OSCO: TP13.1 U2.3(OSCO) X1.3(OUTPUT)
RESET#/OE/A: R16.2 TP7.1 U8.1(A) U9.1(RESET#)
RESET#/OE/B: R17.2 TP8.1 U7.1(RESET#) U8.2(B)
RESET#/OE/Y: TP12.1 U8.4(Y) U10.10(OE)
TCK_CONN: H1.5 U17.10 U18.10 U19.10
TDI_CONN: H1.9 U17.6 U18.6 U19.6
TDO_CONN: H1.7 U17.8 U18.8 U19.8
TMS_CONN: H1.11 U17.4 U18.4 U19.4
UART_RXD: R9.1 U2.39(BDBUS1) U10.4(A3)
UART_RXD_CONN: U20.1 U21.1
UART_RXD_O: U3.1 U10.17(B3)
UART_TXD: R7.2 U2.38(BDBUS0) U10.3(A2)
UART_TXD_CONN: U20.2 U21.2
UART_TXD_O: U3.2 U10.18(B2)
USB_5V: C17.2 R12.2 TP2.1 U4.6(IN) USB1.2(VBUS) USB1.11(VBUS)
USB_CC1: R2.2 USB1.4(CC1)
USB_CC2: R1.2 USB1.10(CC2)
USB_DN: L1.5(D-) USB1.5(DN2) USB1.7(DN1)
USB_DN_O: L1.2(D-) U2.7(DM)
USB_DP: L1.6(D+) USB1.6(DP1) USB1.8(DP2)
USB_DP_O: L1.1(D+) U2.8(DP)
VCORE: C9.2 C10.2 C11.2 C13.1 TP1.1 U2.12(VCORE) U2.37(VCORE) U2.49(VREGOUT) U2.64(VCORE)
VREF_CONN: H1.1 H1.2 U17.2 U18.2 U19.2
VREF_SEL: R21.2 SW1.7 U16.4(PR1)
$1N3333: L3.2 U2.4(VPHY)
$1N3334: L2.1 U2.9(VPLL)
$1N3341: R14.2 U2.6(REF)
$1N3343: R15.2 U2.14(RESET#)
$1N3498: R20.2 U16.5(MODE)
$1N3540: R12.1 U4.4(EN)
$1N3543: R6.1 U4.2(ILIM)
$1N3546: C12.1 C15.1(IN) U5.1(IN)
$1N3571: C30.1 U11.13(NR/SS)
$1N3574: C31.2 U11.3(FB)
$1N4563: LED1.1(C) R3.2
$1N5175: C21.2 U9.4(CT)
$1N6583: C22.2 U7.4(CT)
$1N7350: Q1.2(G1) R5.2 R7.1
$1N7411: Q1.5(G2) R8.1 R9.2
$1N7511: LED2.2(A) R4.1
$1N7515: LED2.1(C) Q1.6(D1)
$1N7583: LED3.2(A) R13.2
$1N7590: LED3.1(C) Q1.3(D2)

Not connected (* = marked no-connect by the designer): U1 12* 14*; U2 21(ADBUS4)* 22(ADBUS5)* 23(ADBUS6)* 24(ADBUS7)* 26(ACBUS0)* 27(ACBUS1)* 28(ACBUS2)* 29(ACBUS3)* 30(ACBUS4)* 32(ACBUS5)* 33(ACBUS6)* 34(ACBUS7)* 36(SUSPEND#)* 40(BDBUS2)* 41(BDBUS3)* 43(BDBUS4)* 44(BDBUS5)* 45(BDBUS6)* 46(BDBUS7)* 48(BCBUS0)* 52(BCBUS1)* 53(BCBUS2)* 54(BCBUS3)* 55(BCBUS4)* 57(BCBUS5)* 58(BCBUS6)* 59(BCBUS7)* 60(PWREN#)*; U4 3(FAULT#)*; U5 4(NC)*; U10 1(A1)* 9(A8)* 12(B8)* 20(B1)*; U11 4(PG)* 5(50mV)* 12(BIAS)*; U16 8(ST)*; U17 12* 14*; USB1 3(SBU2)* 9(SBU1)*

## Notes on the sheets
sheet 1
- I limit is 1.7A
- USB & 3V3
- JTAG & UART
- FT2232HQ
- Enable after both 3V3 & VCCB are stable
- LEVEL SHIFTER & RESET
- VOLTAGE LEVEL SWITCH
sheet 2
- 14PIN to (6PIN + UART)
- 14PIN to 14PIN
sheet 3
- LEVEL SHIFTER & RESET
- USB & 3V3
- FT2232HQ
- JTAG & UART
- VOLTAGE LEVEL SWITCH
- 14PIN to (6PIN + UART)
- 14PIN to 14PIN
